# EAGLE schematic powerpartial (EAGLE 7.2.0)
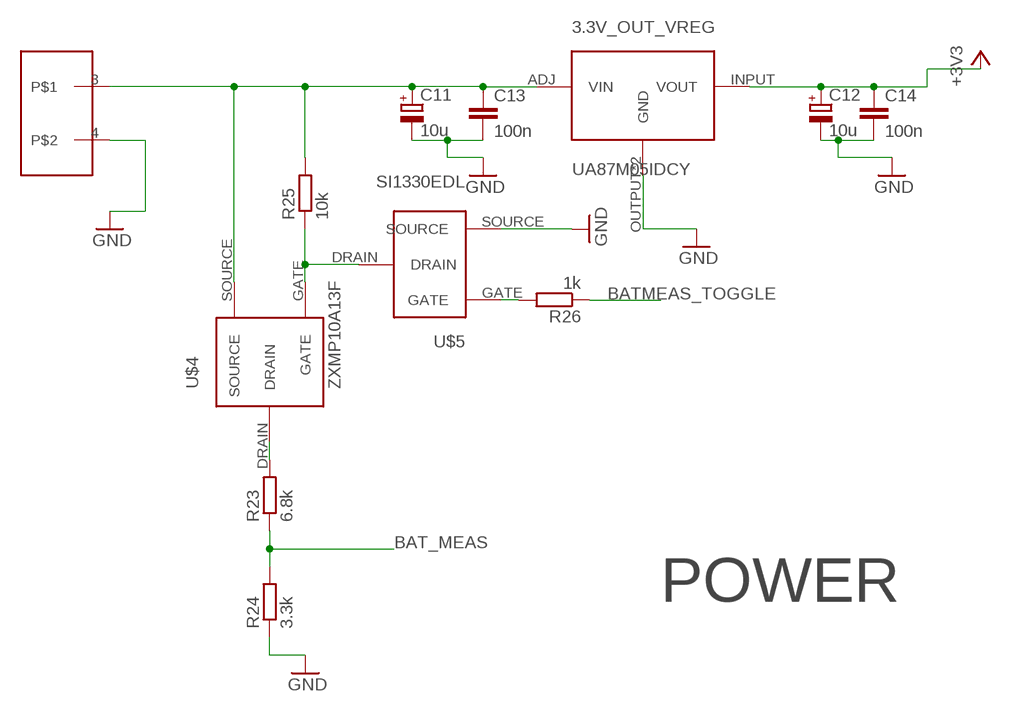
[diagram p0: schematic, sheet 1]

## Parts
3.3V_OUT_VREG  UA87M05IDCY  [SOT223]
C11  10u  CPOL-EU153CLV-0505  [153CLV-0505]
C12  10u  CPOL-EU153CLV-0505  [153CLV-0505]
C13  100n  C-EUC0805  [C0805]
C14  100n  C-EUC0805  [C0805]
R23  6.8k  R-EU_R0805  [R0805]
R24  3.3k  R-EU_R0805  [R0805]
R25  10k  R-EU_R0805  [R0805]
R26  1k  R-EU_R0805  [R0805]
SKRUVPLINT_2P5  SKRUVPLINT_2P  [SKRUVPLINT_2P]
U$4  ZXMP10A13F  [P-CHANNEL]
U$5  SI1330EDL  [SOT-323]

## Nets
+3V3: 3.3V_OUT_VREG.INPUT(VOUT) C12.+ C14.1
BAT_MEAS: R23.1 R24.2
BATMEAS_TOGGLE: R26.1
GND: 3.3V_OUT_VREG.OUTPUT(GND) 3.3V_OUT_VREG.VOUT(GND) C11.- C12.- C13.2 C14.2 R24.1 SKRUVPLINT_2P5.4 U$5.SOURCE
N$25: R23.2 U$4.DRAIN
N$26: R25.1 U$4.GATE U$5.DRAIN
N$27: R26.2 U$5.GATE
N$29: 3.3V_OUT_VREG.ADJ(VIN) C11.+ C13.1 R25.2 SKRUVPLINT_2P5.3 U$4.SOURCE

## Notes on the sheet
- POWER

## Library data of the parts
3.3V_OUT_VREG = Minakomp:UA87M05IDCY
C11 C12 = rcl:CPOL-EU: POLARIZED CAPACITOR, European symbol
C13 C14 = rcl:C-EU: CAPACITOR, European symbol
R23-R26 = rcl:R-EU_: RESISTOR, European symbol
SKRUVPLINT_2P5 = skruvplint2p_CTB0700:SKRUVPLINT_2P
U$4 = ZXMP10A13F:ZXMP10A13F
U$5 = SI1330EDL:SI1330EDL